# Altium schematic sheet IO.schdoc
size 262 x 182 mm
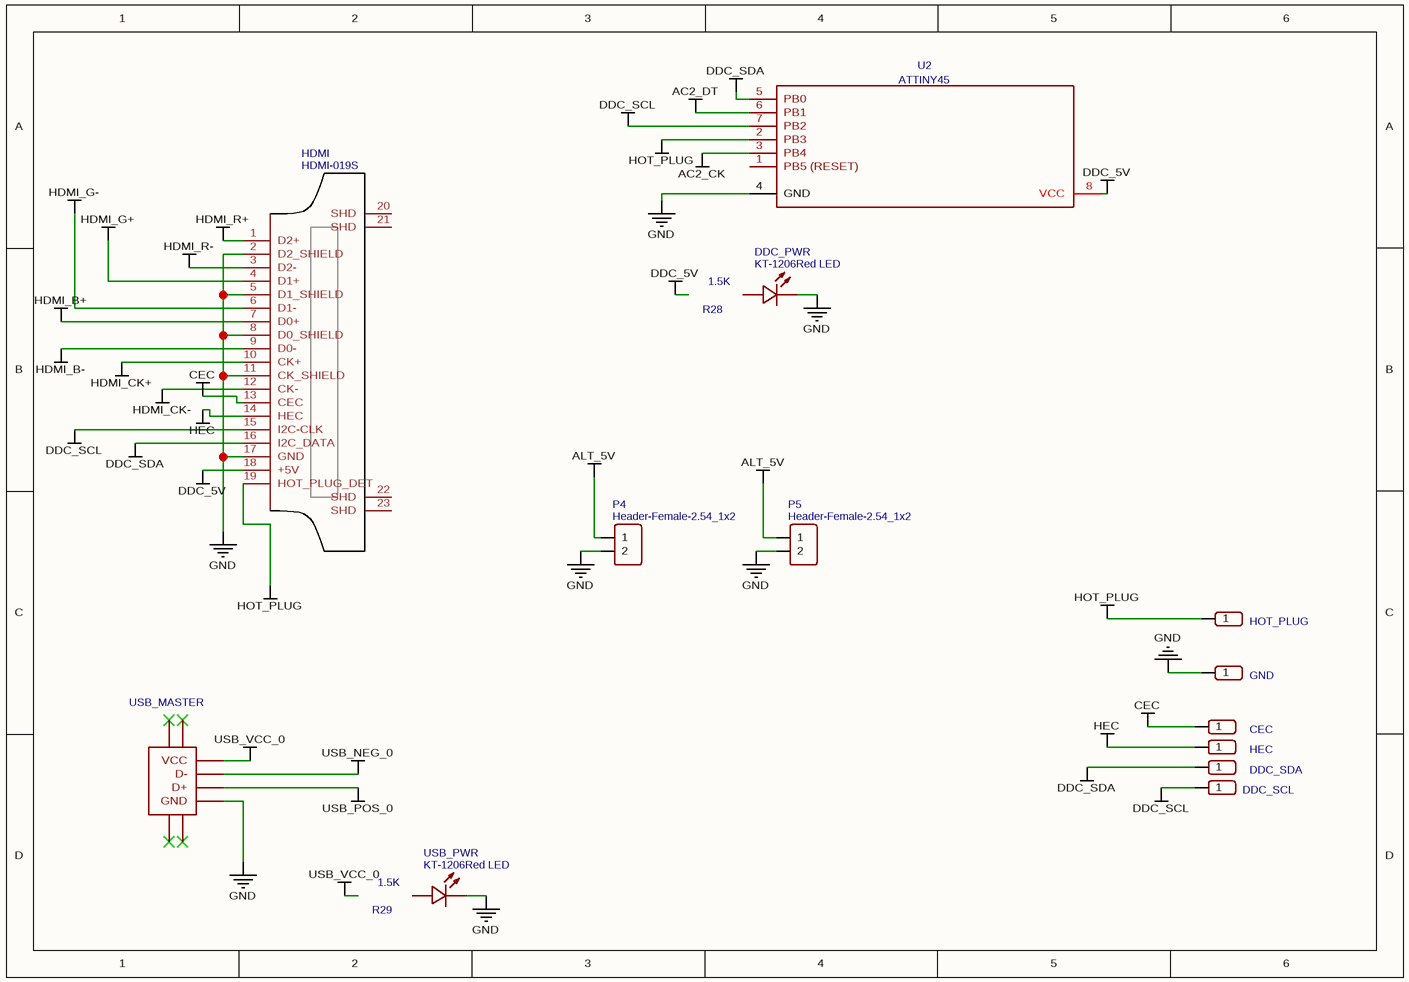
[diagram p0: IO.schdoc]

## Parts
CEC  TestPoint  [HDR-1X1/2.54]  (value not drawn)
DDC_PWR  KT-1206Red LED  [LED-1206]
DDC_SCL  TestPoint  [HDR-1X1/2.54]  (value not drawn)
DDC_SDA  TestPoint  [HDR-1X1/2.54]  (value not drawn)
GND  TestPoint  [HDR-1X1/2.54]  (value not drawn)
HDMI  HDMI-019S  [HDMI-019S]
HEC  TestPoint  [HDR-1X1/2.54]  (value not drawn)
HOT_PLUG  TestPoint  [HDR-1X1/2.54]  (value not drawn)
P4  Header-Female-2.54_1x2  [HDR-1X2/2.54]
P5  Header-Female-2.54_1x2  [HDR-1X2/2.54]
R28  1.5K  [1206]
R29  1.5K  [1206]
U2  ATTINY45  [DIP-8]
USB_MASTER  A  [USB-M-24]  (value not drawn)
USB_PWR  KT-1206Red LED  [LED-1206]

## Nets
AC2_CK: U2.3(PB4)
AC2_DT: U2.6(PB1)
ALT_5V: P4.1 P5.1
CEC: CEC.1 HDMI.13(CEC)
DDC_5V: HDMI.18(+5V) U2.8(VCC)
DDC_SCL: DDC_SCL.1 HDMI.15(I2C-CLK) U2.7(PB2)
DDC_SDA: DDC_SDA.1 HDMI.16(I2C_DATA) U2.5(PB0)
GND: DDC_PWR.2(K) GND.1 HDMI.2(D2_SHIELD) HDMI.5(D1_SHIELD) HDMI.8(D0_SHIELD) HDMI.11(CK_SHIELD) HDMI.17(GND) P4.2 P5.2 U2.4(GND) USB_MASTER.4(GND) USB_PWR.2(K)
HDMI_B+: HDMI.7(D0+)
HDMI_B-: HDMI.9(D0-)
HDMI_CK+: HDMI.10(CK+)
HDMI_CK-: HDMI.12(CK-)
HDMI_G+: HDMI.4(D1+)
HDMI_G-: HDMI.6(D1-)
HDMI_R+: HDMI.1(D2+)
HDMI_R-: HDMI.3(D2-)
HEC: HDMI.14(HEC) HEC.1
HOT_PLUG: HDMI.19(HOT_PLUG_DET) HOT_PLUG.1 U2.2(PB3)
USB_NEG_0: USB_MASTER.2(D-)
USB_POS_0: USB_MASTER.3(D+)
USB_VCC_0: USB_MASTER.1(VCC)

Not connected (* = marked no-connect by the designer): DDC_PWR 1(A); HDMI 20(SHD) 21(SHD) 22(SHD) 23(SHD); U2 1(PB5_(RESET)); USB_MASTER 0*; USB_PWR 1(A)

## Library data of the parts
CEC DDC_SCL DDC_SDA GND HEC HOT_PLUG = TestPoint: BOM_Manufacturer: ReliaPro; BOM_Manufacturer Part: Header-Male-2.54_1x1; BOM_Supplier: LCSC; BOM_Supplier Part: C81276; spicePre: P
DDC_PWR USB_PWR = KT-1206Red LED: BOM_Manufacturer: KENTO; SMT Type: Extend; BOM_Supplier: LCSC; BOM_Manufacturer Part: KT-1206Red LED; image: //image.lceda.cn/szlcsc/C49018.jpg; BOM_Supplier Part: C49018; BOM_LCSC Assembly: Yes; spicePre: L
HDMI = HDMI-019S: BOM_Manufacturer: SOFNG; BOM_Supplier: LCSC; BOM_Manufacturer Part: HDMI-019S; BOM_Supplier Part: C111617; spicePre: U
P4 P5 = Header-Female-2.54_1x2: BOM_Manufacturer: BOOMELE; BOM_Manufacturer Part: 2.54-1*2PFemale; BOM_Supplier: LCSC; image: //image.lceda.cn/szlcsc/C49661.jpg; BOM_Supplier Part: C49661; spicePre: P
R28 R29 = 1.5K: BOM_Manufacturer: YAGEO; BOM_Manufacturer Part: AC1206JR-071K5L; nameAlias: Resistance (Ohms); Contributor: LCSC; BOM_Supplier: LCSC; BOM_Supplier Part: C144466; spicePre: R; spiceSymbolName: AC1206JR-071K5L
U2 = ATTINY45: BOM_Manufacturer: MICROCHIP; BOM_Manufacturer Part: ATTINY45-20PU; Contributor: LCSC; BOM_Supplier: LCSC; BOM_Supplier Part: C152181; spicePre: U
USB_MASTER = A: BOM_Manufacturer: ValuePro; BOM_Manufacturer Part: A/F90degree Aparagraph 10Four feet without curling ironPBTWhite plastic6.8; BOM_Supplier: LCSC; image: //image.lceda.cn/szlcsc/C42580.jpg; BOM_Supplier Part: C42580; spicePre: U